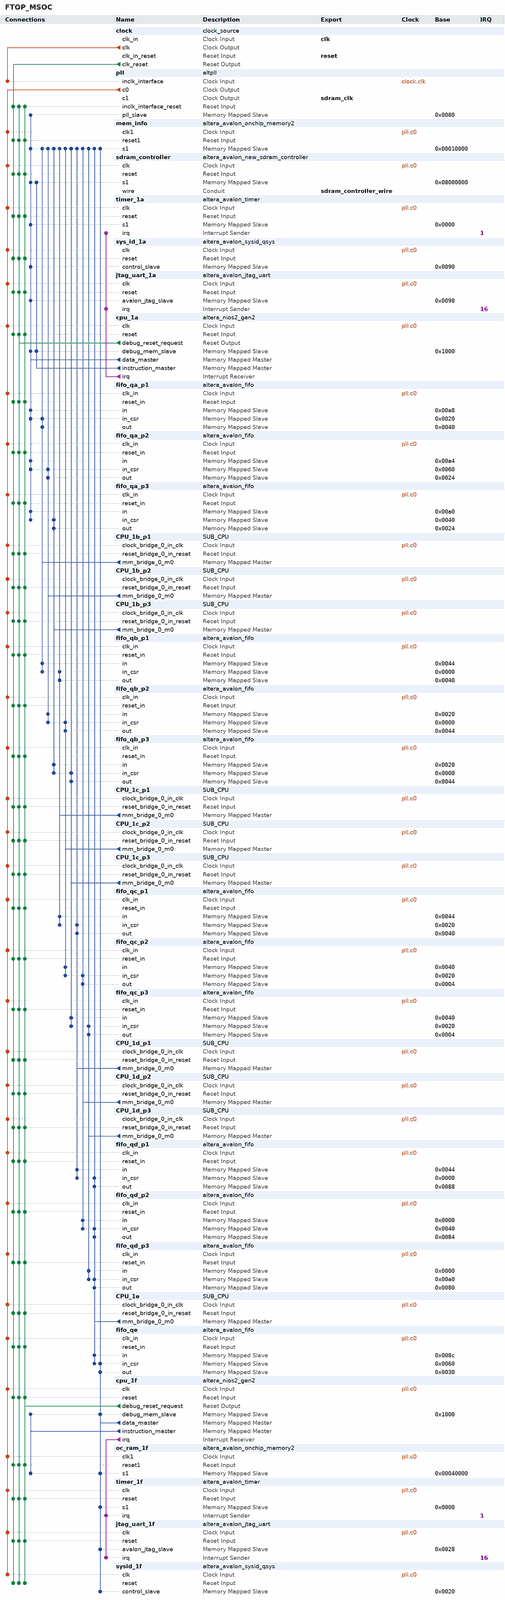
[diagram p0: system contents, whole]
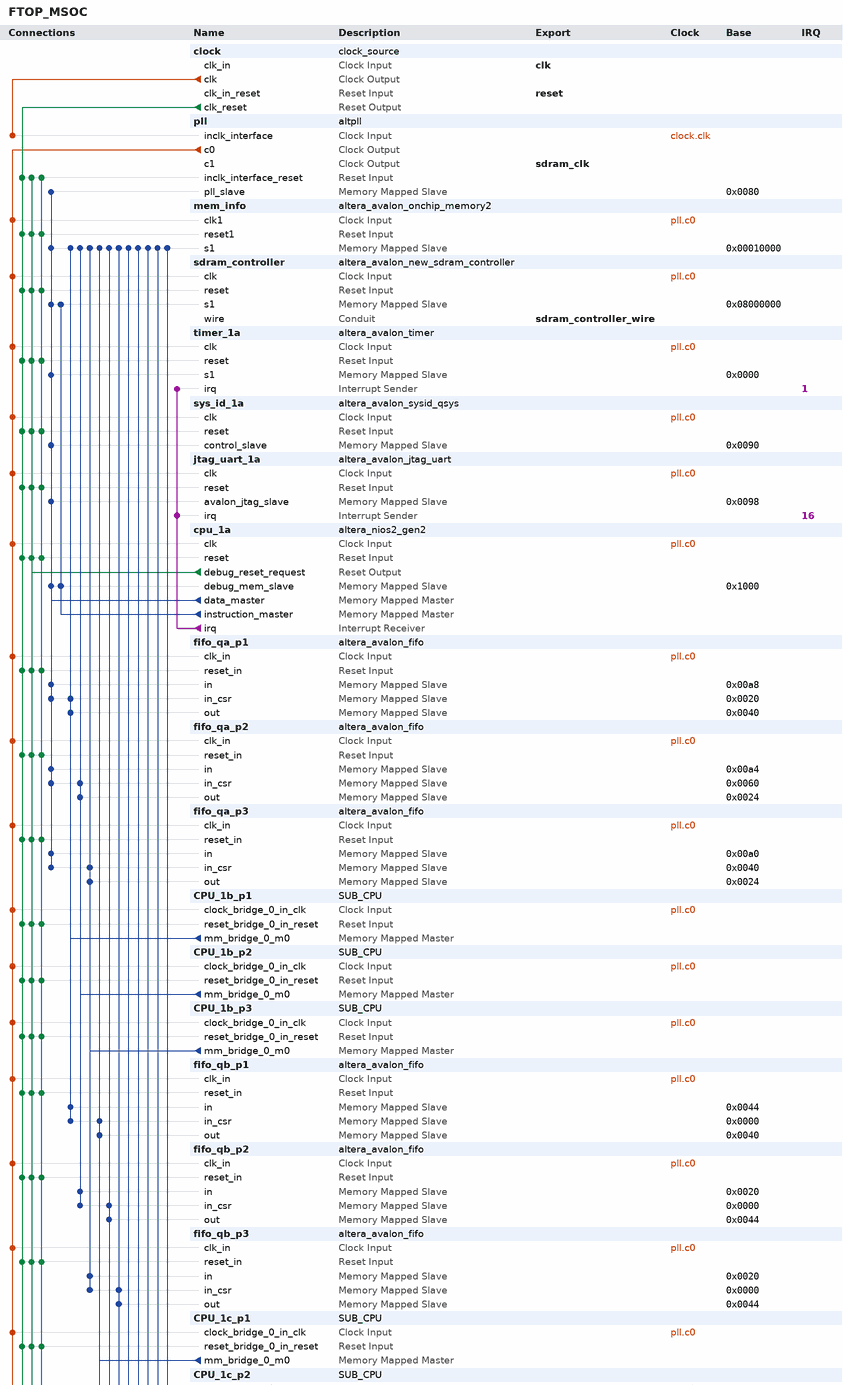
[diagram p1: system contents, upper part]
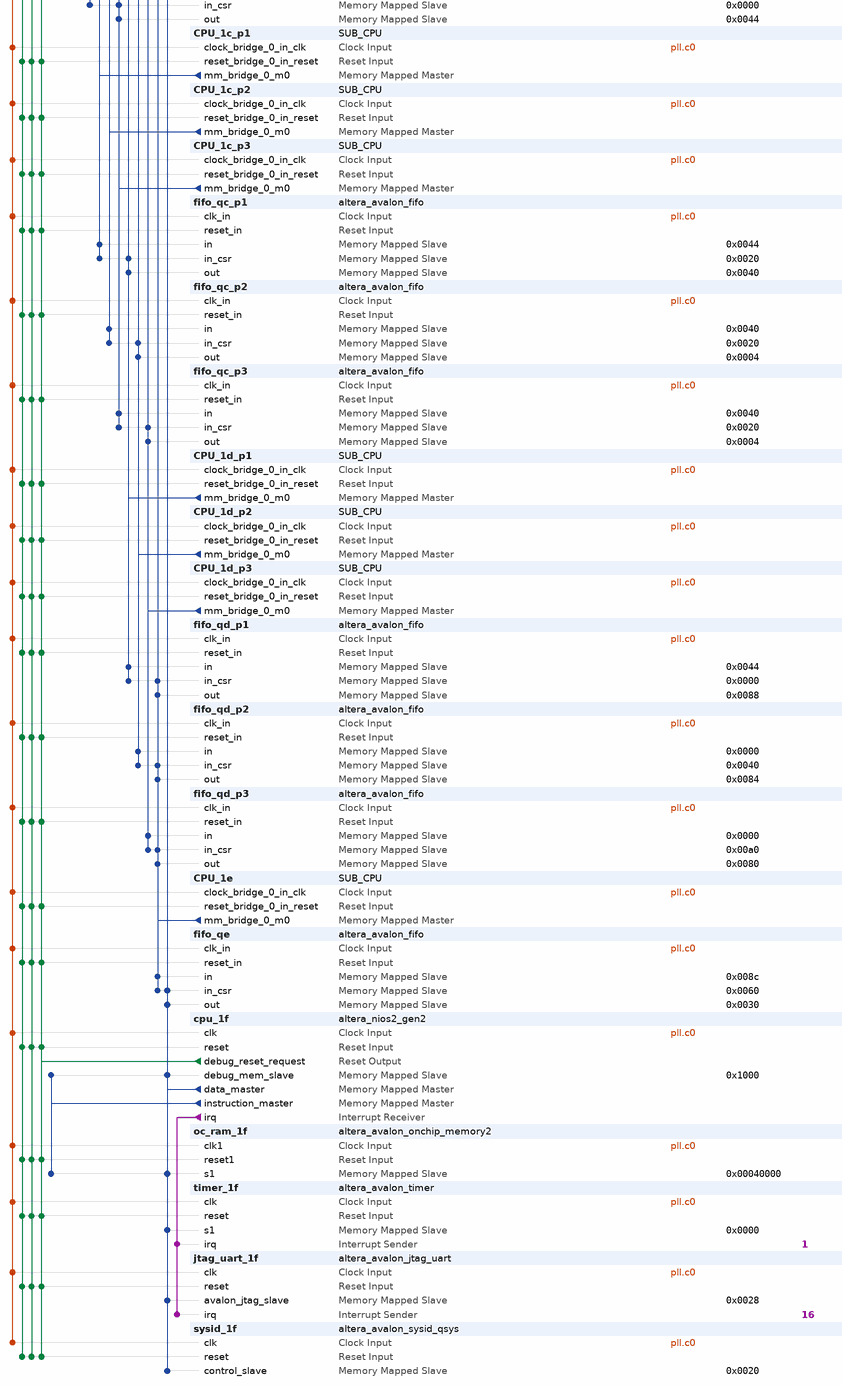
[diagram p2: system contents, lower part]
# Platform Designer (Qsys) system FTOP_MSOC, Cyclone IV E EP4CE115F29C7
# Parameters at their usual value, and those the tool derives, are not listed.
package require -exact qsys 18.1
create_system FTOP_MSOC
set_project_property DEVICE_FAMILY {Cyclone IV E}
set_project_property DEVICE EP4CE115F29C7

add_instance clock clock_source 18.1
set_instance_parameter_value clock clockFrequency 50000000

add_instance pll altpll 18.1
set_instance_parameter_value pll CLK0_DIVIDE_BY 2
set_instance_parameter_value pll CLK0_MULTIPLY_BY 3
set_instance_parameter_value pll CLK1_DIVIDE_BY 2
set_instance_parameter_value pll CLK1_DUTY_CYCLE 50
set_instance_parameter_value pll CLK1_MULTIPLY_BY 3
set_instance_parameter_value pll CLK1_PHASE_SHIFT -2407
set_instance_parameter_value pll INCLK0_INPUT_FREQUENCY 20000
set_instance_parameter_value pll PORT_ARESET PORT_UNUSED
set_instance_parameter_value pll PORT_LOCKED PORT_UNUSED
set_instance_parameter_value pll PORT_clk1 PORT_USED
set_instance_parameter_value pll PORT_clk2 PORT_UNUSED
set_instance_parameter_value pll PORT_clk3 PORT_UNUSED

add_instance mem_info altera_avalon_onchip_memory2 18.1
set_instance_parameter_value mem_info dataWidth 32
set_instance_parameter_value mem_info dualPort false
set_instance_parameter_value mem_info initMemContent true
set_instance_parameter_value mem_info initializationFileName onchip_mem.hex
set_instance_parameter_value mem_info memorySize 1024

add_instance sdram_controller altera_avalon_new_sdram_controller 18.1
set_instance_parameter_value sdram_controller TAC 6.0
set_instance_parameter_value sdram_controller TRCD 20.0
set_instance_parameter_value sdram_controller TRP 20.0
set_instance_parameter_value sdram_controller casLatency 3
set_instance_parameter_value sdram_controller columnWidth 10
set_instance_parameter_value sdram_controller dataWidth 32
set_instance_parameter_value sdram_controller generateSimulationModel false
set_instance_parameter_value sdram_controller model single_Micron_MT48LC4M32B2_7_chip
set_instance_parameter_value sdram_controller numberOfBanks 4
set_instance_parameter_value sdram_controller numberOfChipSelects 1
set_instance_parameter_value sdram_controller powerUpDelay 100.0
set_instance_parameter_value sdram_controller refreshPeriod 15.625
set_instance_parameter_value sdram_controller rowWidth 13

add_instance timer_1a altera_avalon_timer 18.1
set_instance_parameter_value timer_1a period 1
set_instance_parameter_value timer_1a periodUnits MSEC

add_instance sys_id_1a altera_avalon_sysid_qsys 18.1
set_instance_parameter_value sys_id_1a id 26

add_instance jtag_uart_1a altera_avalon_jtag_uart 18.1
set_instance_parameter_value jtag_uart_1a simInteractiveOptions NO_INTERACTIVE_WINDOWS

add_instance cpu_1a altera_nios2_gen2 18.1
set_instance_parameter_value cpu_1a dcache_size 2048
set_instance_parameter_value cpu_1a exceptionOffset 262176
set_instance_parameter_value cpu_1a exceptionSlave sdram_controller.s1
set_instance_parameter_value cpu_1a icache_size 4096
set_instance_parameter_value cpu_1a impl Tiny
set_instance_parameter_value cpu_1a resetOffset 262144
set_instance_parameter_value cpu_1a resetSlave sdram_controller.s1
set_instance_parameter_value cpu_1a setting_activateTrace true

add_instance fifo_qa_p1 altera_avalon_fifo 18.1
set_instance_parameter_value fifo_qa_p1 bitsPerSymbol 16
set_instance_parameter_value fifo_qa_p1 channelWidth 8
set_instance_parameter_value fifo_qa_p1 errorWidth 8
set_instance_parameter_value fifo_qa_p1 fifoDepth 256
set_instance_parameter_value fifo_qa_p1 fifoInputInterfaceOptions AVALONMM_WRITE
set_instance_parameter_value fifo_qa_p1 fifoOutputInterfaceOptions AVALONMM_READ
set_instance_parameter_value fifo_qa_p1 singleClockMode true
set_instance_parameter_value fifo_qa_p1 symbolsPerBeat 2
set_instance_parameter_value fifo_qa_p1 useIRQ false
set_instance_parameter_value fifo_qa_p1 usePacket true
set_instance_parameter_value fifo_qa_p1 useReadControl false

add_instance fifo_qa_p2 altera_avalon_fifo 18.1
set_instance_parameter_value fifo_qa_p2 bitsPerSymbol 16
set_instance_parameter_value fifo_qa_p2 channelWidth 8
set_instance_parameter_value fifo_qa_p2 errorWidth 8
set_instance_parameter_value fifo_qa_p2 fifoDepth 256
set_instance_parameter_value fifo_qa_p2 fifoInputInterfaceOptions AVALONMM_WRITE
set_instance_parameter_value fifo_qa_p2 fifoOutputInterfaceOptions AVALONMM_READ
set_instance_parameter_value fifo_qa_p2 singleClockMode true
set_instance_parameter_value fifo_qa_p2 symbolsPerBeat 2
set_instance_parameter_value fifo_qa_p2 useIRQ false
set_instance_parameter_value fifo_qa_p2 usePacket true
set_instance_parameter_value fifo_qa_p2 useReadControl false

add_instance fifo_qa_p3 altera_avalon_fifo 18.1
set_instance_parameter_value fifo_qa_p3 bitsPerSymbol 16
set_instance_parameter_value fifo_qa_p3 channelWidth 8
set_instance_parameter_value fifo_qa_p3 errorWidth 8
set_instance_parameter_value fifo_qa_p3 fifoDepth 256
set_instance_parameter_value fifo_qa_p3 fifoInputInterfaceOptions AVALONMM_WRITE
set_instance_parameter_value fifo_qa_p3 fifoOutputInterfaceOptions AVALONMM_READ
set_instance_parameter_value fifo_qa_p3 singleClockMode true
set_instance_parameter_value fifo_qa_p3 symbolsPerBeat 2
set_instance_parameter_value fifo_qa_p3 useIRQ false
set_instance_parameter_value fifo_qa_p3 usePacket true
set_instance_parameter_value fifo_qa_p3 useReadControl false

add_instance CPU_1b_p1 SUB_CPU 1.0

add_instance CPU_1b_p2 SUB_CPU 1.0

add_instance CPU_1b_p3 SUB_CPU 1.0

add_instance fifo_qb_p1 altera_avalon_fifo 18.1
set_instance_parameter_value fifo_qb_p1 bitsPerSymbol 16
set_instance_parameter_value fifo_qb_p1 channelWidth 8
set_instance_parameter_value fifo_qb_p1 errorWidth 8
set_instance_parameter_value fifo_qb_p1 fifoDepth 32
set_instance_parameter_value fifo_qb_p1 fifoInputInterfaceOptions AVALONMM_WRITE
set_instance_parameter_value fifo_qb_p1 fifoOutputInterfaceOptions AVALONMM_READ
set_instance_parameter_value fifo_qb_p1 singleClockMode true
set_instance_parameter_value fifo_qb_p1 symbolsPerBeat 2
set_instance_parameter_value fifo_qb_p1 useIRQ false
set_instance_parameter_value fifo_qb_p1 usePacket true
set_instance_parameter_value fifo_qb_p1 useReadControl false

add_instance fifo_qb_p2 altera_avalon_fifo 18.1
set_instance_parameter_value fifo_qb_p2 bitsPerSymbol 16
set_instance_parameter_value fifo_qb_p2 channelWidth 8
set_instance_parameter_value fifo_qb_p2 errorWidth 8
set_instance_parameter_value fifo_qb_p2 fifoDepth 32
set_instance_parameter_value fifo_qb_p2 fifoInputInterfaceOptions AVALONMM_WRITE
set_instance_parameter_value fifo_qb_p2 fifoOutputInterfaceOptions AVALONMM_READ
set_instance_parameter_value fifo_qb_p2 singleClockMode true
set_instance_parameter_value fifo_qb_p2 symbolsPerBeat 2
set_instance_parameter_value fifo_qb_p2 useIRQ false
set_instance_parameter_value fifo_qb_p2 usePacket true
set_instance_parameter_value fifo_qb_p2 useReadControl false

add_instance fifo_qb_p3 altera_avalon_fifo 18.1
set_instance_parameter_value fifo_qb_p3 bitsPerSymbol 16
set_instance_parameter_value fifo_qb_p3 channelWidth 8
set_instance_parameter_value fifo_qb_p3 errorWidth 8
set_instance_parameter_value fifo_qb_p3 fifoDepth 32
set_instance_parameter_value fifo_qb_p3 fifoInputInterfaceOptions AVALONMM_WRITE
set_instance_parameter_value fifo_qb_p3 fifoOutputInterfaceOptions AVALONMM_READ
set_instance_parameter_value fifo_qb_p3 singleClockMode true
set_instance_parameter_value fifo_qb_p3 symbolsPerBeat 2
set_instance_parameter_value fifo_qb_p3 useIRQ false
set_instance_parameter_value fifo_qb_p3 usePacket true
set_instance_parameter_value fifo_qb_p3 useReadControl false

add_instance CPU_1c_p1 SUB_CPU 1.0

add_instance CPU_1c_p2 SUB_CPU 1.0

add_instance CPU_1c_p3 SUB_CPU 1.0

add_instance fifo_qc_p1 altera_avalon_fifo 18.1
set_instance_parameter_value fifo_qc_p1 bitsPerSymbol 16
set_instance_parameter_value fifo_qc_p1 channelWidth 8
set_instance_parameter_value fifo_qc_p1 errorWidth 8
set_instance_parameter_value fifo_qc_p1 fifoDepth 32
set_instance_parameter_value fifo_qc_p1 fifoInputInterfaceOptions AVALONMM_WRITE
set_instance_parameter_value fifo_qc_p1 fifoOutputInterfaceOptions AVALONMM_READ
set_instance_parameter_value fifo_qc_p1 singleClockMode true
set_instance_parameter_value fifo_qc_p1 symbolsPerBeat 2
set_instance_parameter_value fifo_qc_p1 useIRQ false
set_instance_parameter_value fifo_qc_p1 usePacket true
set_instance_parameter_value fifo_qc_p1 useReadControl false

add_instance fifo_qc_p2 altera_avalon_fifo 18.1
set_instance_parameter_value fifo_qc_p2 bitsPerSymbol 16
set_instance_parameter_value fifo_qc_p2 channelWidth 8
set_instance_parameter_value fifo_qc_p2 errorWidth 8
set_instance_parameter_value fifo_qc_p2 fifoDepth 32
set_instance_parameter_value fifo_qc_p2 fifoInputInterfaceOptions AVALONMM_WRITE
set_instance_parameter_value fifo_qc_p2 fifoOutputInterfaceOptions AVALONMM_READ
set_instance_parameter_value fifo_qc_p2 singleClockMode true
set_instance_parameter_value fifo_qc_p2 symbolsPerBeat 2
set_instance_parameter_value fifo_qc_p2 useIRQ false
set_instance_parameter_value fifo_qc_p2 usePacket true
set_instance_parameter_value fifo_qc_p2 useReadControl false

add_instance fifo_qc_p3 altera_avalon_fifo 18.1
set_instance_parameter_value fifo_qc_p3 bitsPerSymbol 16
set_instance_parameter_value fifo_qc_p3 channelWidth 8
set_instance_parameter_value fifo_qc_p3 errorWidth 8
set_instance_parameter_value fifo_qc_p3 fifoDepth 32
set_instance_parameter_value fifo_qc_p3 fifoInputInterfaceOptions AVALONMM_WRITE
set_instance_parameter_value fifo_qc_p3 fifoOutputInterfaceOptions AVALONMM_READ
set_instance_parameter_value fifo_qc_p3 singleClockMode true
set_instance_parameter_value fifo_qc_p3 symbolsPerBeat 2
set_instance_parameter_value fifo_qc_p3 useIRQ false
set_instance_parameter_value fifo_qc_p3 usePacket true
set_instance_parameter_value fifo_qc_p3 useReadControl false

add_instance CPU_1d_p1 SUB_CPU 1.0

add_instance CPU_1d_p2 SUB_CPU 1.0

add_instance CPU_1d_p3 SUB_CPU 1.0

add_instance fifo_qd_p1 altera_avalon_fifo 18.1
set_instance_parameter_value fifo_qd_p1 bitsPerSymbol 16
set_instance_parameter_value fifo_qd_p1 channelWidth 8
set_instance_parameter_value fifo_qd_p1 errorWidth 8
set_instance_parameter_value fifo_qd_p1 fifoDepth 32
set_instance_parameter_value fifo_qd_p1 fifoInputInterfaceOptions AVALONMM_WRITE
set_instance_parameter_value fifo_qd_p1 fifoOutputInterfaceOptions AVALONMM_READ
set_instance_parameter_value fifo_qd_p1 singleClockMode true
set_instance_parameter_value fifo_qd_p1 symbolsPerBeat 2
set_instance_parameter_value fifo_qd_p1 useIRQ false
set_instance_parameter_value fifo_qd_p1 usePacket true
set_instance_parameter_value fifo_qd_p1 useReadControl false

add_instance fifo_qd_p2 altera_avalon_fifo 18.1
set_instance_parameter_value fifo_qd_p2 bitsPerSymbol 16
set_instance_parameter_value fifo_qd_p2 channelWidth 8
set_instance_parameter_value fifo_qd_p2 errorWidth 8
set_instance_parameter_value fifo_qd_p2 fifoDepth 32
set_instance_parameter_value fifo_qd_p2 fifoInputInterfaceOptions AVALONMM_WRITE
set_instance_parameter_value fifo_qd_p2 fifoOutputInterfaceOptions AVALONMM_READ
set_instance_parameter_value fifo_qd_p2 singleClockMode true
set_instance_parameter_value fifo_qd_p2 symbolsPerBeat 2
set_instance_parameter_value fifo_qd_p2 useIRQ false
set_instance_parameter_value fifo_qd_p2 usePacket true
set_instance_parameter_value fifo_qd_p2 useReadControl false

add_instance fifo_qd_p3 altera_avalon_fifo 18.1
set_instance_parameter_value fifo_qd_p3 bitsPerSymbol 16
set_instance_parameter_value fifo_qd_p3 channelWidth 8
set_instance_parameter_value fifo_qd_p3 errorWidth 8
set_instance_parameter_value fifo_qd_p3 fifoDepth 32
set_instance_parameter_value fifo_qd_p3 fifoInputInterfaceOptions AVALONMM_WRITE
set_instance_parameter_value fifo_qd_p3 fifoOutputInterfaceOptions AVALONMM_READ
set_instance_parameter_value fifo_qd_p3 singleClockMode true
set_instance_parameter_value fifo_qd_p3 symbolsPerBeat 2
set_instance_parameter_value fifo_qd_p3 useIRQ false
set_instance_parameter_value fifo_qd_p3 usePacket true
set_instance_parameter_value fifo_qd_p3 useReadControl false

add_instance CPU_1e SUB_CPU 1.0

add_instance fifo_qe altera_avalon_fifo 18.1
set_instance_parameter_value fifo_qe bitsPerSymbol 16
set_instance_parameter_value fifo_qe channelWidth 8
set_instance_parameter_value fifo_qe errorWidth 8
set_instance_parameter_value fifo_qe fifoDepth 32
set_instance_parameter_value fifo_qe fifoInputInterfaceOptions AVALONMM_WRITE
set_instance_parameter_value fifo_qe fifoOutputInterfaceOptions AVALONMM_READ
set_instance_parameter_value fifo_qe singleClockMode true
set_instance_parameter_value fifo_qe symbolsPerBeat 2
set_instance_parameter_value fifo_qe useIRQ false
set_instance_parameter_value fifo_qe usePacket true
set_instance_parameter_value fifo_qe useReadControl false

add_instance cpu_1f altera_nios2_gen2 18.1
set_instance_parameter_value cpu_1f dcache_size 2048
set_instance_parameter_value cpu_1f exceptionSlave oc_ram_1f.s1
set_instance_parameter_value cpu_1f icache_size 4096
set_instance_parameter_value cpu_1f impl Tiny
set_instance_parameter_value cpu_1f resetSlave oc_ram_1f.s1
set_instance_parameter_value cpu_1f setting_activateTrace true

add_instance oc_ram_1f altera_avalon_onchip_memory2 18.1
set_instance_parameter_value oc_ram_1f dataWidth 32
set_instance_parameter_value oc_ram_1f dualPort false
set_instance_parameter_value oc_ram_1f initMemContent true
set_instance_parameter_value oc_ram_1f initializationFileName onchip_mem.hex
set_instance_parameter_value oc_ram_1f memorySize 102400

add_instance timer_1f altera_avalon_timer 18.1
set_instance_parameter_value timer_1f period 1
set_instance_parameter_value timer_1f periodUnits MSEC

add_instance jtag_uart_1f altera_avalon_jtag_uart 18.1
set_instance_parameter_value jtag_uart_1f simInteractiveOptions NO_INTERACTIVE_WINDOWS

add_instance sysid_1f altera_avalon_sysid_qsys 18.1
set_instance_parameter_value sysid_1f id 31

# connections
add_connection clock.clk pll.inclk_interface clock
add_connection pll.c0 cpu_1a.clk clock
add_connection pll.c0 CPU_1b_p1.clock_bridge_0_in_clk clock
add_connection pll.c0 CPU_1b_p2.clock_bridge_0_in_clk clock
add_connection pll.c0 CPU_1b_p3.clock_bridge_0_in_clk clock
add_connection pll.c0 CPU_1c_p1.clock_bridge_0_in_clk clock
add_connection pll.c0 CPU_1c_p2.clock_bridge_0_in_clk clock
add_connection pll.c0 CPU_1c_p3.clock_bridge_0_in_clk clock
add_connection pll.c0 CPU_1d_p1.clock_bridge_0_in_clk clock
add_connection pll.c0 CPU_1d_p2.clock_bridge_0_in_clk clock
add_connection pll.c0 CPU_1d_p3.clock_bridge_0_in_clk clock
add_connection pll.c0 CPU_1e.clock_bridge_0_in_clk clock
add_connection pll.c0 cpu_1f.clk clock
add_connection pll.c0 fifo_qa_p1.clk_in clock
add_connection pll.c0 fifo_qa_p2.clk_in clock
add_connection pll.c0 fifo_qa_p3.clk_in clock
add_connection pll.c0 fifo_qb_p1.clk_in clock
add_connection pll.c0 fifo_qb_p2.clk_in clock
add_connection pll.c0 fifo_qb_p3.clk_in clock
add_connection pll.c0 fifo_qc_p1.clk_in clock
add_connection pll.c0 fifo_qc_p2.clk_in clock
add_connection pll.c0 fifo_qc_p3.clk_in clock
add_connection pll.c0 fifo_qd_p1.clk_in clock
add_connection pll.c0 fifo_qd_p2.clk_in clock
add_connection pll.c0 fifo_qd_p3.clk_in clock
add_connection pll.c0 fifo_qe.clk_in clock
add_connection pll.c0 jtag_uart_1a.clk clock
add_connection pll.c0 jtag_uart_1f.clk clock
add_connection pll.c0 mem_info.clk1 clock
add_connection pll.c0 oc_ram_1f.clk1 clock
add_connection pll.c0 sdram_controller.clk clock
add_connection pll.c0 sys_id_1a.clk clock
add_connection pll.c0 sysid_1f.clk clock
add_connection pll.c0 timer_1a.clk clock
add_connection pll.c0 timer_1f.clk clock
add_connection clock.clk_reset cpu_1a.reset reset
add_connection clock.clk_reset CPU_1b_p1.reset_bridge_0_in_reset reset
add_connection clock.clk_reset CPU_1b_p2.reset_bridge_0_in_reset reset
add_connection clock.clk_reset CPU_1b_p3.reset_bridge_0_in_reset reset
add_connection clock.clk_reset CPU_1c_p1.reset_bridge_0_in_reset reset
add_connection clock.clk_reset CPU_1c_p2.reset_bridge_0_in_reset reset
add_connection clock.clk_reset CPU_1c_p3.reset_bridge_0_in_reset reset
add_connection clock.clk_reset CPU_1d_p1.reset_bridge_0_in_reset reset
add_connection clock.clk_reset CPU_1d_p2.reset_bridge_0_in_reset reset
add_connection clock.clk_reset CPU_1d_p3.reset_bridge_0_in_reset reset
add_connection clock.clk_reset CPU_1e.reset_bridge_0_in_reset reset
add_connection clock.clk_reset cpu_1f.reset reset
add_connection clock.clk_reset fifo_qa_p1.reset_in reset
add_connection clock.clk_reset fifo_qa_p2.reset_in reset
add_connection clock.clk_reset fifo_qa_p3.reset_in reset
add_connection clock.clk_reset fifo_qb_p1.reset_in reset
add_connection clock.clk_reset fifo_qb_p2.reset_in reset
add_connection clock.clk_reset fifo_qb_p3.reset_in reset
add_connection clock.clk_reset fifo_qc_p1.reset_in reset
add_connection clock.clk_reset fifo_qc_p2.reset_in reset
add_connection clock.clk_reset fifo_qc_p3.reset_in reset
add_connection clock.clk_reset fifo_qd_p1.reset_in reset
add_connection clock.clk_reset fifo_qd_p2.reset_in reset
add_connection clock.clk_reset fifo_qd_p3.reset_in reset
add_connection clock.clk_reset fifo_qe.reset_in reset
add_connection clock.clk_reset jtag_uart_1a.reset reset
add_connection clock.clk_reset jtag_uart_1f.reset reset
add_connection clock.clk_reset mem_info.reset1 reset
add_connection clock.clk_reset oc_ram_1f.reset1 reset
add_connection clock.clk_reset pll.inclk_interface_reset reset
add_connection clock.clk_reset sdram_controller.reset reset
add_connection clock.clk_reset sys_id_1a.reset reset
add_connection clock.clk_reset sysid_1f.reset reset
add_connection clock.clk_reset timer_1a.reset reset
add_connection clock.clk_reset timer_1f.reset reset
add_connection cpu_1a.debug_reset_request cpu_1a.reset reset
add_connection cpu_1a.debug_reset_request CPU_1b_p1.reset_bridge_0_in_reset reset
add_connection cpu_1a.debug_reset_request CPU_1b_p2.reset_bridge_0_in_reset reset
add_connection cpu_1a.debug_reset_request CPU_1b_p3.reset_bridge_0_in_reset reset
add_connection cpu_1a.debug_reset_request CPU_1c_p1.reset_bridge_0_in_reset reset
add_connection cpu_1a.debug_reset_request CPU_1c_p2.reset_bridge_0_in_reset reset
add_connection cpu_1a.debug_reset_request CPU_1c_p3.reset_bridge_0_in_reset reset
add_connection cpu_1a.debug_reset_request CPU_1d_p1.reset_bridge_0_in_reset reset
add_connection cpu_1a.debug_reset_request CPU_1d_p2.reset_bridge_0_in_reset reset
add_connection cpu_1a.debug_reset_request CPU_1d_p3.reset_bridge_0_in_reset reset
add_connection cpu_1a.debug_reset_request CPU_1e.reset_bridge_0_in_reset reset
add_connection cpu_1a.debug_reset_request cpu_1f.reset reset
add_connection cpu_1a.debug_reset_request fifo_qa_p1.reset_in reset
add_connection cpu_1a.debug_reset_request fifo_qa_p2.reset_in reset
add_connection cpu_1a.debug_reset_request fifo_qa_p3.reset_in reset
add_connection cpu_1a.debug_reset_request fifo_qb_p1.reset_in reset
add_connection cpu_1a.debug_reset_request fifo_qb_p2.reset_in reset
add_connection cpu_1a.debug_reset_request fifo_qb_p3.reset_in reset
add_connection cpu_1a.debug_reset_request fifo_qc_p1.reset_in reset
add_connection cpu_1a.debug_reset_request fifo_qc_p2.reset_in reset
add_connection cpu_1a.debug_reset_request fifo_qc_p3.reset_in reset
add_connection cpu_1a.debug_reset_request fifo_qd_p1.reset_in reset
add_connection cpu_1a.debug_reset_request fifo_qd_p2.reset_in reset
add_connection cpu_1a.debug_reset_request fifo_qd_p3.reset_in reset
add_connection cpu_1a.debug_reset_request fifo_qe.reset_in reset
add_connection cpu_1a.debug_reset_request jtag_uart_1a.reset reset
add_connection cpu_1a.debug_reset_request jtag_uart_1f.reset reset
add_connection cpu_1a.debug_reset_request mem_info.reset1 reset
add_connection cpu_1a.debug_reset_request oc_ram_1f.reset1 reset
add_connection cpu_1a.debug_reset_request pll.inclk_interface_reset reset
add_connection cpu_1a.debug_reset_request sdram_controller.reset reset
add_connection cpu_1a.debug_reset_request sys_id_1a.reset reset
add_connection cpu_1a.debug_reset_request sysid_1f.reset reset
add_connection cpu_1a.debug_reset_request timer_1a.reset reset
add_connection cpu_1a.debug_reset_request timer_1f.reset reset
add_connection cpu_1f.debug_reset_request cpu_1a.reset reset
add_connection cpu_1f.debug_reset_request CPU_1b_p1.reset_bridge_0_in_reset reset
add_connection cpu_1f.debug_reset_request CPU_1b_p2.reset_bridge_0_in_reset reset
add_connection cpu_1f.debug_reset_request CPU_1b_p3.reset_bridge_0_in_reset reset
add_connection cpu_1f.debug_reset_request CPU_1c_p1.reset_bridge_0_in_reset reset
add_connection cpu_1f.debug_reset_request CPU_1c_p2.reset_bridge_0_in_reset reset
add_connection cpu_1f.debug_reset_request CPU_1c_p3.reset_bridge_0_in_reset reset
add_connection cpu_1f.debug_reset_request CPU_1d_p1.reset_bridge_0_in_reset reset
add_connection cpu_1f.debug_reset_request CPU_1d_p2.reset_bridge_0_in_reset reset
add_connection cpu_1f.debug_reset_request CPU_1d_p3.reset_bridge_0_in_reset reset
add_connection cpu_1f.debug_reset_request CPU_1e.reset_bridge_0_in_reset reset
add_connection cpu_1f.debug_reset_request cpu_1f.reset reset
add_connection cpu_1f.debug_reset_request fifo_qa_p1.reset_in reset
add_connection cpu_1f.debug_reset_request fifo_qa_p2.reset_in reset
add_connection cpu_1f.debug_reset_request fifo_qa_p3.reset_in reset
add_connection cpu_1f.debug_reset_request fifo_qb_p1.reset_in reset
add_connection cpu_1f.debug_reset_request fifo_qb_p2.reset_in reset
add_connection cpu_1f.debug_reset_request fifo_qb_p3.reset_in reset
add_connection cpu_1f.debug_reset_request fifo_qc_p1.reset_in reset
add_connection cpu_1f.debug_reset_request fifo_qc_p2.reset_in reset
add_connection cpu_1f.debug_reset_request fifo_qc_p3.reset_in reset
add_connection cpu_1f.debug_reset_request fifo_qd_p1.reset_in reset
add_connection cpu_1f.debug_reset_request fifo_qd_p2.reset_in reset
add_connection cpu_1f.debug_reset_request fifo_qd_p3.reset_in reset
add_connection cpu_1f.debug_reset_request fifo_qe.reset_in reset
add_connection cpu_1f.debug_reset_request jtag_uart_1a.reset reset
add_connection cpu_1f.debug_reset_request jtag_uart_1f.reset reset
add_connection cpu_1f.debug_reset_request mem_info.reset1 reset
add_connection cpu_1f.debug_reset_request oc_ram_1f.reset1 reset
add_connection cpu_1f.debug_reset_request pll.inclk_interface_reset reset
add_connection cpu_1f.debug_reset_request sdram_controller.reset reset
add_connection cpu_1f.debug_reset_request sys_id_1a.reset reset
add_connection cpu_1f.debug_reset_request sysid_1f.reset reset
add_connection cpu_1f.debug_reset_request timer_1a.reset reset
add_connection cpu_1f.debug_reset_request timer_1f.reset reset
add_connection cpu_1a.data_master cpu_1a.debug_mem_slave avalon
set_connection_parameter_value cpu_1a.data_master/cpu_1a.debug_mem_slave baseAddress 0x1000
add_connection cpu_1a.data_master fifo_qa_p1.in avalon
set_connection_parameter_value cpu_1a.data_master/fifo_qa_p1.in baseAddress 0x00a8
add_connection cpu_1a.data_master fifo_qa_p1.in_csr avalon
set_connection_parameter_value cpu_1a.data_master/fifo_qa_p1.in_csr baseAddress 0x0020
add_connection cpu_1a.data_master fifo_qa_p2.in avalon
set_connection_parameter_value cpu_1a.data_master/fifo_qa_p2.in baseAddress 0x00a4
add_connection cpu_1a.data_master fifo_qa_p2.in_csr avalon
set_connection_parameter_value cpu_1a.data_master/fifo_qa_p2.in_csr baseAddress 0x0060
add_connection cpu_1a.data_master fifo_qa_p3.in avalon
set_connection_parameter_value cpu_1a.data_master/fifo_qa_p3.in baseAddress 0x00a0
add_connection cpu_1a.data_master fifo_qa_p3.in_csr avalon
set_connection_parameter_value cpu_1a.data_master/fifo_qa_p3.in_csr baseAddress 0x0040
add_connection cpu_1a.data_master jtag_uart_1a.avalon_jtag_slave avalon
set_connection_parameter_value cpu_1a.data_master/jtag_uart_1a.avalon_jtag_slave baseAddress 0x0098
add_connection cpu_1a.data_master mem_info.s1 avalon
set_connection_parameter_value cpu_1a.data_master/mem_info.s1 baseAddress 0x00010000
add_connection cpu_1a.data_master pll.pll_slave avalon
set_connection_parameter_value cpu_1a.data_master/pll.pll_slave baseAddress 0x0080
add_connection cpu_1a.data_master sdram_controller.s1 avalon
set_connection_parameter_value cpu_1a.data_master/sdram_controller.s1 baseAddress 0x08000000
add_connection cpu_1a.data_master sys_id_1a.control_slave avalon
set_connection_parameter_value cpu_1a.data_master/sys_id_1a.control_slave baseAddress 0x0090
add_connection cpu_1a.data_master timer_1a.s1 avalon
set_connection_parameter_value cpu_1a.data_master/timer_1a.s1 baseAddress 0x0000
add_connection cpu_1a.instruction_master cpu_1a.debug_mem_slave avalon
set_connection_parameter_value cpu_1a.instruction_master/cpu_1a.debug_mem_slave baseAddress 0x1000
add_connection cpu_1a.instruction_master sdram_controller.s1 avalon
set_connection_parameter_value cpu_1a.instruction_master/sdram_controller.s1 baseAddress 0x08000000
add_connection CPU_1b_p1.mm_bridge_0_m0 fifo_qa_p1.in_csr avalon
set_connection_parameter_value CPU_1b_p1.mm_bridge_0_m0/fifo_qa_p1.in_csr baseAddress 0x0020
add_connection CPU_1b_p1.mm_bridge_0_m0 fifo_qa_p1.out avalon
set_connection_parameter_value CPU_1b_p1.mm_bridge_0_m0/fifo_qa_p1.out baseAddress 0x0040
add_connection CPU_1b_p1.mm_bridge_0_m0 fifo_qb_p1.in avalon
set_connection_parameter_value CPU_1b_p1.mm_bridge_0_m0/fifo_qb_p1.in baseAddress 0x0044
add_connection CPU_1b_p1.mm_bridge_0_m0 fifo_qb_p1.in_csr avalon
set_connection_parameter_value CPU_1b_p1.mm_bridge_0_m0/fifo_qb_p1.in_csr baseAddress 0x0000
add_connection CPU_1b_p1.mm_bridge_0_m0 mem_info.s1 avalon
set_connection_parameter_value CPU_1b_p1.mm_bridge_0_m0/mem_info.s1 baseAddress 0x00010000
add_connection CPU_1b_p2.mm_bridge_0_m0 fifo_qa_p2.in_csr avalon
set_connection_parameter_value CPU_1b_p2.mm_bridge_0_m0/fifo_qa_p2.in_csr baseAddress 0x0060
add_connection CPU_1b_p2.mm_bridge_0_m0 fifo_qa_p2.out avalon
set_connection_parameter_value CPU_1b_p2.mm_bridge_0_m0/fifo_qa_p2.out baseAddress 0x0024
add_connection CPU_1b_p2.mm_bridge_0_m0 fifo_qb_p2.in avalon
set_connection_parameter_value CPU_1b_p2.mm_bridge_0_m0/fifo_qb_p2.in baseAddress 0x0020
add_connection CPU_1b_p2.mm_bridge_0_m0 fifo_qb_p2.in_csr avalon
set_connection_parameter_value CPU_1b_p2.mm_bridge_0_m0/fifo_qb_p2.in_csr baseAddress 0x0000
add_connection CPU_1b_p2.mm_bridge_0_m0 mem_info.s1 avalon
set_connection_parameter_value CPU_1b_p2.mm_bridge_0_m0/mem_info.s1 baseAddress 0x00010000
add_connection CPU_1b_p3.mm_bridge_0_m0 fifo_qa_p3.in_csr avalon
set_connection_parameter_value CPU_1b_p3.mm_bridge_0_m0/fifo_qa_p3.in_csr baseAddress 0x0040
add_connection CPU_1b_p3.mm_bridge_0_m0 fifo_qa_p3.out avalon
set_connection_parameter_value CPU_1b_p3.mm_bridge_0_m0/fifo_qa_p3.out baseAddress 0x0024
add_connection CPU_1b_p3.mm_bridge_0_m0 fifo_qb_p3.in avalon
set_connection_parameter_value CPU_1b_p3.mm_bridge_0_m0/fifo_qb_p3.in baseAddress 0x0020
add_connection CPU_1b_p3.mm_bridge_0_m0 fifo_qb_p3.in_csr avalon
set_connection_parameter_value CPU_1b_p3.mm_bridge_0_m0/fifo_qb_p3.in_csr baseAddress 0x0000
add_connection CPU_1b_p3.mm_bridge_0_m0 mem_info.s1 avalon
set_connection_parameter_value CPU_1b_p3.mm_bridge_0_m0/mem_info.s1 baseAddress 0x00010000
add_connection CPU_1c_p1.mm_bridge_0_m0 fifo_qb_p1.in_csr avalon
set_connection_parameter_value CPU_1c_p1.mm_bridge_0_m0/fifo_qb_p1.in_csr baseAddress 0x0000
add_connection CPU_1c_p1.mm_bridge_0_m0 fifo_qb_p1.out avalon
set_connection_parameter_value CPU_1c_p1.mm_bridge_0_m0/fifo_qb_p1.out baseAddress 0x0040
add_connection CPU_1c_p1.mm_bridge_0_m0 fifo_qc_p1.in avalon
set_connection_parameter_value CPU_1c_p1.mm_bridge_0_m0/fifo_qc_p1.in baseAddress 0x0044
add_connection CPU_1c_p1.mm_bridge_0_m0 fifo_qc_p1.in_csr avalon
set_connection_parameter_value CPU_1c_p1.mm_bridge_0_m0/fifo_qc_p1.in_csr baseAddress 0x0020
add_connection CPU_1c_p1.mm_bridge_0_m0 mem_info.s1 avalon
set_connection_parameter_value CPU_1c_p1.mm_bridge_0_m0/mem_info.s1 baseAddress 0x00010000
add_connection CPU_1c_p2.mm_bridge_0_m0 fifo_qb_p2.in_csr avalon
set_connection_parameter_value CPU_1c_p2.mm_bridge_0_m0/fifo_qb_p2.in_csr baseAddress 0x0000
add_connection CPU_1c_p2.mm_bridge_0_m0 fifo_qb_p2.out avalon
set_connection_parameter_value CPU_1c_p2.mm_bridge_0_m0/fifo_qb_p2.out baseAddress 0x0044
add_connection CPU_1c_p2.mm_bridge_0_m0 fifo_qc_p2.in avalon
set_connection_parameter_value CPU_1c_p2.mm_bridge_0_m0/fifo_qc_p2.in baseAddress 0x0040
add_connection CPU_1c_p2.mm_bridge_0_m0 fifo_qc_p2.in_csr avalon
set_connection_parameter_value CPU_1c_p2.mm_bridge_0_m0/fifo_qc_p2.in_csr baseAddress 0x0020
add_connection CPU_1c_p2.mm_bridge_0_m0 mem_info.s1 avalon
set_connection_parameter_value CPU_1c_p2.mm_bridge_0_m0/mem_info.s1 baseAddress 0x00010000
add_connection CPU_1c_p3.mm_bridge_0_m0 fifo_qb_p3.in_csr avalon
set_connection_parameter_value CPU_1c_p3.mm_bridge_0_m0/fifo_qb_p3.in_csr baseAddress 0x0000
add_connection CPU_1c_p3.mm_bridge_0_m0 fifo_qb_p3.out avalon
set_connection_parameter_value CPU_1c_p3.mm_bridge_0_m0/fifo_qb_p3.out baseAddress 0x0044
add_connection CPU_1c_p3.mm_bridge_0_m0 fifo_qc_p3.in avalon
set_connection_parameter_value CPU_1c_p3.mm_bridge_0_m0/fifo_qc_p3.in baseAddress 0x0040
add_connection CPU_1c_p3.mm_bridge_0_m0 fifo_qc_p3.in_csr avalon
set_connection_parameter_value CPU_1c_p3.mm_bridge_0_m0/fifo_qc_p3.in_csr baseAddress 0x0020
add_connection CPU_1c_p3.mm_bridge_0_m0 mem_info.s1 avalon
set_connection_parameter_value CPU_1c_p3.mm_bridge_0_m0/mem_info.s1 baseAddress 0x00010000
add_connection CPU_1d_p1.mm_bridge_0_m0 fifo_qc_p1.in_csr avalon
set_connection_parameter_value CPU_1d_p1.mm_bridge_0_m0/fifo_qc_p1.in_csr baseAddress 0x0020
add_connection CPU_1d_p1.mm_bridge_0_m0 fifo_qc_p1.out avalon
set_connection_parameter_value CPU_1d_p1.mm_bridge_0_m0/fifo_qc_p1.out baseAddress 0x0040
add_connection CPU_1d_p1.mm_bridge_0_m0 fifo_qd_p1.in avalon
set_connection_parameter_value CPU_1d_p1.mm_bridge_0_m0/fifo_qd_p1.in baseAddress 0x0044
add_connection CPU_1d_p1.mm_bridge_0_m0 fifo_qd_p1.in_csr avalon
set_connection_parameter_value CPU_1d_p1.mm_bridge_0_m0/fifo_qd_p1.in_csr baseAddress 0x0000
add_connection CPU_1d_p1.mm_bridge_0_m0 mem_info.s1 avalon
set_connection_parameter_value CPU_1d_p1.mm_bridge_0_m0/mem_info.s1 baseAddress 0x00010000
add_connection CPU_1d_p2.mm_bridge_0_m0 fifo_qc_p2.in_csr avalon
set_connection_parameter_value CPU_1d_p2.mm_bridge_0_m0/fifo_qc_p2.in_csr baseAddress 0x0020
add_connection CPU_1d_p2.mm_bridge_0_m0 fifo_qc_p2.out avalon
set_connection_parameter_value CPU_1d_p2.mm_bridge_0_m0/fifo_qc_p2.out baseAddress 0x0004
add_connection CPU_1d_p2.mm_bridge_0_m0 fifo_qd_p2.in avalon
set_connection_parameter_value CPU_1d_p2.mm_bridge_0_m0/fifo_qd_p2.in baseAddress 0x0000
add_connection CPU_1d_p2.mm_bridge_0_m0 fifo_qd_p2.in_csr avalon
set_connection_parameter_value CPU_1d_p2.mm_bridge_0_m0/fifo_qd_p2.in_csr baseAddress 0x0040
add_connection CPU_1d_p2.mm_bridge_0_m0 mem_info.s1 avalon
set_connection_parameter_value CPU_1d_p2.mm_bridge_0_m0/mem_info.s1 baseAddress 0x00010000
add_connection CPU_1d_p3.mm_bridge_0_m0 fifo_qc_p3.in_csr avalon
set_connection_parameter_value CPU_1d_p3.mm_bridge_0_m0/fifo_qc_p3.in_csr baseAddress 0x0020
add_connection CPU_1d_p3.mm_bridge_0_m0 fifo_qc_p3.out avalon
set_connection_parameter_value CPU_1d_p3.mm_bridge_0_m0/fifo_qc_p3.out baseAddress 0x0004
add_connection CPU_1d_p3.mm_bridge_0_m0 fifo_qd_p3.in avalon
set_connection_parameter_value CPU_1d_p3.mm_bridge_0_m0/fifo_qd_p3.in baseAddress 0x0000
add_connection CPU_1d_p3.mm_bridge_0_m0 fifo_qd_p3.in_csr avalon
set_connection_parameter_value CPU_1d_p3.mm_bridge_0_m0/fifo_qd_p3.in_csr baseAddress 0x00a0
add_connection CPU_1d_p3.mm_bridge_0_m0 mem_info.s1 avalon
set_connection_parameter_value CPU_1d_p3.mm_bridge_0_m0/mem_info.s1 baseAddress 0x00010000
add_connection CPU_1e.mm_bridge_0_m0 fifo_qd_p1.in_csr avalon
set_connection_parameter_value CPU_1e.mm_bridge_0_m0/fifo_qd_p1.in_csr baseAddress 0x0000
add_connection CPU_1e.mm_bridge_0_m0 fifo_qd_p1.out avalon
set_connection_parameter_value CPU_1e.mm_bridge_0_m0/fifo_qd_p1.out baseAddress 0x0088
add_connection CPU_1e.mm_bridge_0_m0 fifo_qd_p2.in_csr avalon
set_connection_parameter_value CPU_1e.mm_bridge_0_m0/fifo_qd_p2.in_csr baseAddress 0x0040
add_connection CPU_1e.mm_bridge_0_m0 fifo_qd_p2.out avalon
set_connection_parameter_value CPU_1e.mm_bridge_0_m0/fifo_qd_p2.out baseAddress 0x0084
add_connection CPU_1e.mm_bridge_0_m0 fifo_qd_p3.in_csr avalon
set_connection_parameter_value CPU_1e.mm_bridge_0_m0/fifo_qd_p3.in_csr baseAddress 0x00a0
add_connection CPU_1e.mm_bridge_0_m0 fifo_qd_p3.out avalon
set_connection_parameter_value CPU_1e.mm_bridge_0_m0/fifo_qd_p3.out baseAddress 0x0080
add_connection CPU_1e.mm_bridge_0_m0 fifo_qe.in avalon
set_connection_parameter_value CPU_1e.mm_bridge_0_m0/fifo_qe.in baseAddress 0x008c
add_connection CPU_1e.mm_bridge_0_m0 fifo_qe.in_csr avalon
set_connection_parameter_value CPU_1e.mm_bridge_0_m0/fifo_qe.in_csr baseAddress 0x0060
add_connection CPU_1e.mm_bridge_0_m0 mem_info.s1 avalon
set_connection_parameter_value CPU_1e.mm_bridge_0_m0/mem_info.s1 baseAddress 0x00010000
add_connection cpu_1f.data_master cpu_1f.debug_mem_slave avalon
set_connection_parameter_value cpu_1f.data_master/cpu_1f.debug_mem_slave baseAddress 0x1000
add_connection cpu_1f.data_master fifo_qe.in_csr avalon
set_connection_parameter_value cpu_1f.data_master/fifo_qe.in_csr baseAddress 0x0060
add_connection cpu_1f.data_master fifo_qe.out avalon
set_connection_parameter_value cpu_1f.data_master/fifo_qe.out baseAddress 0x0030
add_connection cpu_1f.data_master jtag_uart_1f.avalon_jtag_slave avalon
set_connection_parameter_value cpu_1f.data_master/jtag_uart_1f.avalon_jtag_slave baseAddress 0x0028
add_connection cpu_1f.data_master mem_info.s1 avalon
set_connection_parameter_value cpu_1f.data_master/mem_info.s1 baseAddress 0x00010000
add_connection cpu_1f.data_master oc_ram_1f.s1 avalon
set_connection_parameter_value cpu_1f.data_master/oc_ram_1f.s1 baseAddress 0x00040000
add_connection cpu_1f.data_master sysid_1f.control_slave avalon
set_connection_parameter_value cpu_1f.data_master/sysid_1f.control_slave baseAddress 0x0020
add_connection cpu_1f.data_master timer_1f.s1 avalon
set_connection_parameter_value cpu_1f.data_master/timer_1f.s1 baseAddress 0x0000
add_connection cpu_1f.instruction_master cpu_1f.debug_mem_slave avalon
set_connection_parameter_value cpu_1f.instruction_master/cpu_1f.debug_mem_slave baseAddress 0x1000
add_connection cpu_1f.instruction_master oc_ram_1f.s1 avalon
set_connection_parameter_value cpu_1f.instruction_master/oc_ram_1f.s1 baseAddress 0x00040000
add_connection cpu_1a.irq jtag_uart_1a.irq interrupt
set_connection_parameter_value cpu_1a.irq/jtag_uart_1a.irq irqNumber 16
add_connection cpu_1a.irq timer_1a.irq interrupt
set_connection_parameter_value cpu_1a.irq/timer_1a.irq irqNumber 1
add_connection cpu_1f.irq jtag_uart_1f.irq interrupt
set_connection_parameter_value cpu_1f.irq/jtag_uart_1f.irq irqNumber 16
add_connection cpu_1f.irq timer_1f.irq interrupt
set_connection_parameter_value cpu_1f.irq/timer_1f.irq irqNumber 1

# exported interfaces
add_interface clk clock sink
set_interface_property clk EXPORT_OF clock.clk_in
add_interface reset reset sink
set_interface_property reset EXPORT_OF clock.clk_in_reset
add_interface sdram_clk clock source
set_interface_property sdram_clk EXPORT_OF pll.c1
add_interface sdram_controller_wire conduit end
set_interface_property sdram_controller_wire EXPORT_OF sdram_controller.wire

set_interconnect_requirement {$system} qsys_mm.clockCrossingAdapter HANDSHAKE
set_interconnect_requirement {$system} qsys_mm.insertDefaultSlave false
set_interconnect_requirement {$system} qsys_mm.maxAdditionalLatency 1

save_system FTOP_MSOC.qsys
